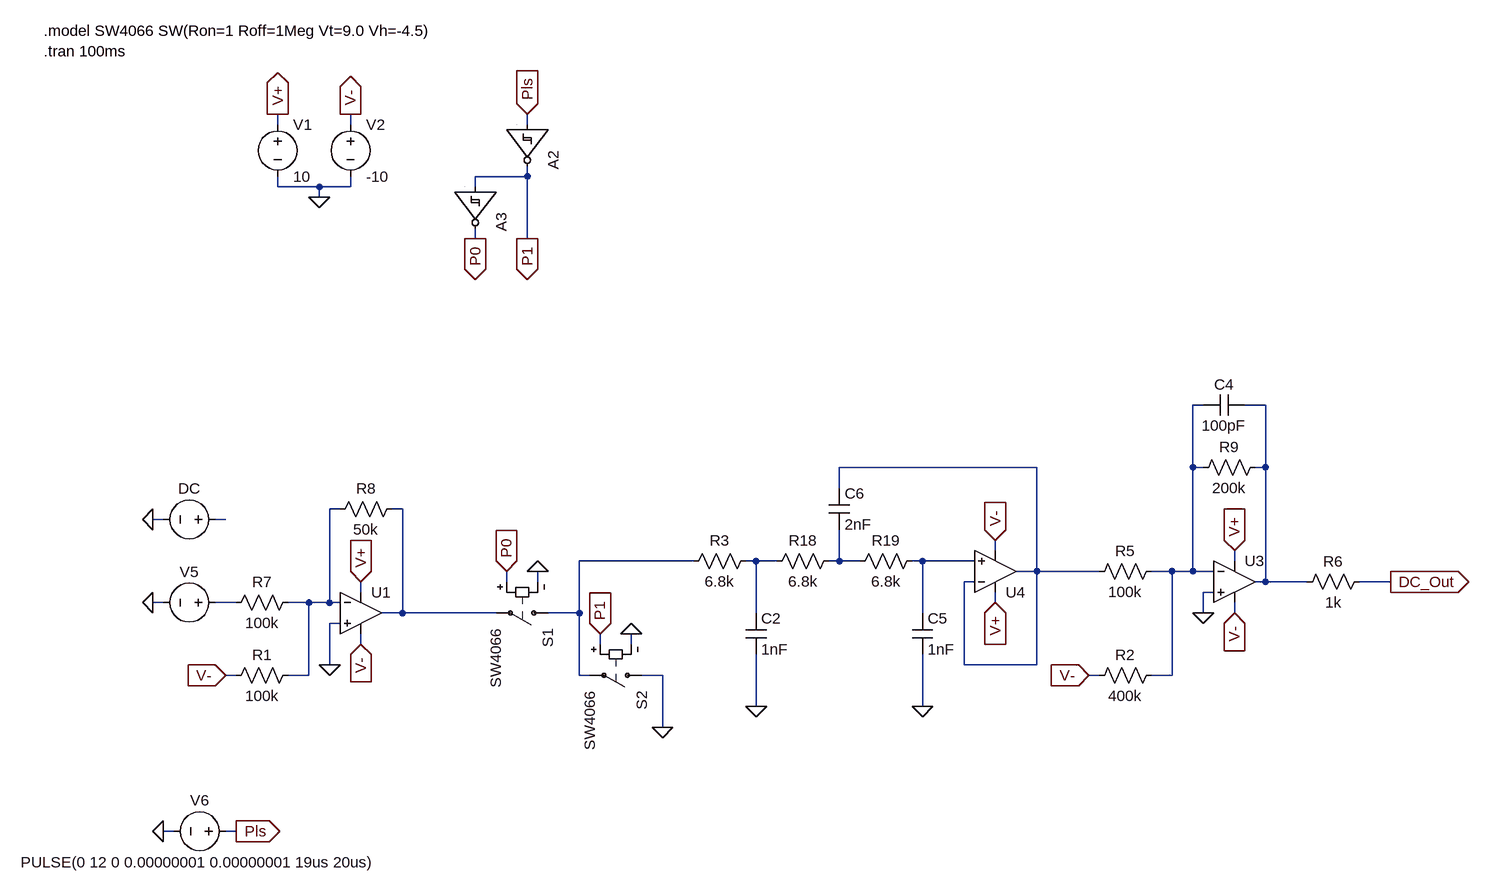
[diagram p0: schematic vca_audio_path_dc_coupled.asc]
vca_audio_path_dc_coupled.asc, the LTspice schematic file:
Version 4
SHEET 1 1140 1560
WIRE -704 176 -704 160
WIRE -592 176 -592 160
WIRE -320 176 -320 160
WIRE -320 256 -320 240
WIRE -320 256 -400 256
WIRE -704 272 -704 256
WIRE -640 272 -704 272
WIRE -592 272 -592 256
WIRE -592 272 -640 272
WIRE -400 272 -400 256
WIRE -640 288 -640 272
WIRE -400 352 -400 336
WIRE -320 352 -320 256
WIRE 720 608 704 608
WIRE 816 608 784 608
WIRE 464 704 160 704
WIRE 704 704 704 608
WIRE 720 704 704 704
WIRE 816 704 816 608
WIRE 816 704 800 704
WIRE 160 736 160 704
WIRE -608 768 -624 768
WIRE -512 768 -528 768
WIRE -880 784 -896 784
WIRE -784 784 -800 784
WIRE 400 832 400 816
WIRE -64 848 -240 848
WIRE 32 848 16 848
WIRE 64 848 32 848
WIRE 160 848 160 800
WIRE 160 848 144 848
WIRE 192 848 160 848
WIRE 288 848 272 848
WIRE 368 848 288 848
WIRE 768 848 768 832
WIRE 464 864 464 704
WIRE 464 864 432 864
WIRE 560 864 464 864
WIRE 672 864 640 864
WIRE 704 864 704 704
WIRE 704 864 672 864
WIRE 736 864 704 864
WIRE -352 880 -352 864
WIRE -304 880 -304 864
WIRE 368 880 352 880
WIRE 816 880 816 704
WIRE 816 880 800 880
WIRE 880 880 816 880
WIRE 1008 880 960 880
WIRE -576 896 -576 880
WIRE 736 896 720 896
WIRE -880 912 -896 912
WIRE -768 912 -800 912
WIRE -656 912 -688 912
WIRE -624 912 -624 768
WIRE -624 912 -656 912
WIRE -608 912 -624 912
WIRE 400 912 400 896
WIRE -512 928 -512 768
WIRE -512 928 -544 928
WIRE -368 928 -512 928
WIRE -240 928 -240 848
WIRE -240 928 -288 928
WIRE 32 928 32 848
WIRE 288 928 288 848
WIRE 720 928 720 896
WIRE 768 928 768 912
WIRE -608 944 -624 944
WIRE -576 976 -576 960
WIRE -208 976 -208 960
WIRE -160 976 -160 960
WIRE -624 1008 -624 944
WIRE 352 1008 352 880
WIRE 464 1008 464 864
WIRE 464 1008 352 1008
WIRE -768 1024 -784 1024
WIRE -656 1024 -656 912
WIRE -656 1024 -688 1024
WIRE -240 1024 -240 928
WIRE -224 1024 -240 1024
WIRE -112 1024 -144 1024
WIRE 560 1024 544 1024
WIRE 672 1024 672 864
WIRE 672 1024 640 1024
WIRE 32 1072 32 992
WIRE 288 1072 288 992
WIRE -112 1104 -112 1024
WIRE -864 1264 -880 1264
WIRE -768 1264 -784 1264
FLAG -592 160 V-
IOPIN -592 160 Out
FLAG -704 160 V+
IOPIN -704 160 Out
FLAG -640 288 0
FLAG -768 1264 Pls
IOPIN -768 1264 Out
FLAG -576 976 V-
IOPIN -576 976 In
FLAG -576 880 V+
IOPIN -576 880 In
FLAG -896 912 0
FLAG -304 864 0
FLAG -320 160 Pls
IOPIN -320 160 In
FLAG -160 960 0
FLAG 400 816 V-
IOPIN 400 816 In
FLAG 400 912 V+
IOPIN 400 912 In
FLAG -880 1264 0
FLAG -112 1104 0
FLAG -624 1008 0
FLAG 768 928 V-
IOPIN 768 928 In
FLAG 768 832 V+
IOPIN 768 832 In
FLAG -320 352 P1
IOPIN -320 352 Out
FLAG -400 352 P0
IOPIN -400 352 Out
FLAG -352 864 P0
IOPIN -352 864 In
FLAG -208 960 P1
IOPIN -208 960 In
FLAG 32 1072 0
FLAG 288 1072 0
FLAG -896 784 0
FLAG -784 1024 V-
IOPIN -784 1024 In
FLAG 544 1024 V-
IOPIN 544 1024 In
FLAG 1008 880 DC_Out
IOPIN 1008 880 Out
FLAG 720 928 0
SYMBOL voltage -704 160 R0
SYMATTR InstName V1
SYMATTR Value 10
SYMBOL voltage -592 160 R0
SYMATTR InstName V2
SYMATTR Value -10
SYMBOL res -672 896 R90
WINDOW 0 0 56 VBottom 2
WINDOW 3 32 56 VTop 2
SYMATTR InstName R7
SYMATTR Value 100k
SYMBOL voltage -784 912 R90
WINDOW 0 -32 56 VBottom 2
WINDOW 3 32 56 Invisible 2
SYMATTR InstName V5
SYMATTR Value PULSE(-5 5 0 2.5ms 2.5ms 0.0ms 5ms)
SYMBOL res -512 752 R90
WINDOW 0 0 56 VBottom 2
WINDOW 3 32 56 VTop 2
SYMATTR InstName R8
SYMATTR Value 50k
SYMBOL sw -272 928 R90
SYMATTR InstName S1
SYMATTR Value SW4066
SYMBOL Digital/schmtinv -256 176 R90
WINDOW 3 8 54 Left 2
SYMATTR InstName A2
SYMATTR SpiceLine VHigh=10 Vt=4.9 Vh=1.0 Trise=1ns Tfall=1ns
SYMBOL sw -128 1024 R90
SYMATTR InstName S2
SYMATTR Value SW4066
SYMBOL Digital/schmtinv -336 272 R90
WINDOW 3 8 54 Left 2
SYMATTR InstName A3
SYMATTR SpiceLine VHigh=10 Vt=4.9 Vh=1.0 Trise=1ns Tfall=1ns
SYMBOL res 160 832 R90
WINDOW 0 0 56 VBottom 2
WINDOW 3 32 56 VTop 2
SYMATTR InstName R18
SYMATTR Value 6.8k
SYMBOL cap 272 928 R0
SYMATTR InstName C5
SYMATTR Value 1nF
SYMBOL cap 144 736 R0
SYMATTR InstName C6
SYMATTR Value 2nF
SYMBOL res 288 832 R90
WINDOW 0 0 56 VBottom 2
WINDOW 3 32 56 VTop 2
SYMATTR InstName R19
SYMATTR Value 6.8k
SYMBOL voltage -768 1264 R90
WINDOW 0 -32 56 VBottom 2
WINDOW 3 32 56 VTop 2
WINDOW 39 0 0 Left 0
SYMATTR InstName V6
SYMATTR Value PULSE(0 12 0 0.00000001 0.00000001 19us 20us)
SYMBOL res 864 896 R270
WINDOW 0 32 56 VTop 2
WINDOW 3 0 56 VBottom 2
SYMATTR InstName R6
SYMATTR Value 1k
SYMBOL res 656 848 R90
WINDOW 0 0 56 VBottom 2
WINDOW 3 32 56 VTop 2
SYMATTR InstName R5
SYMATTR Value 100k
SYMBOL OpAmps/UniversalOpAmp 768 880 R0
SYMATTR InstName U3
SYMBOL OpAmps/UniversalOpAmp 400 864 M180
SYMATTR InstName U4
SYMBOL OpAmps/UniversalOpAmp -576 928 R0
SYMATTR InstName U1
SYMBOL cap 16 928 R0
SYMATTR InstName C2
SYMATTR Value 1nF
SYMBOL res 32 832 R90
WINDOW 0 0 56 VBottom 2
WINDOW 3 32 56 VTop 2
SYMATTR InstName R3
SYMATTR Value 6.8k
SYMBOL cap 784 592 R90
WINDOW 0 0 32 VBottom 2
WINDOW 3 32 32 VTop 2
SYMATTR InstName C4
SYMATTR Value 100pF
SYMBOL res 816 688 R90
WINDOW 0 0 56 VBottom 2
WINDOW 3 32 56 VTop 2
SYMATTR InstName R9
SYMATTR Value 200k
SYMBOL voltage -784 784 R90
WINDOW 0 -32 56 VBottom 2
WINDOW 3 32 56 Invisible 2
SYMATTR InstName DC
SYMATTR Value 7
SYMBOL res -672 1008 R90
WINDOW 0 0 56 VBottom 2
WINDOW 3 32 56 VTop 2
SYMATTR InstName R1
SYMATTR Value 100k
SYMBOL res 656 1008 R90
WINDOW 0 0 56 VBottom 2
WINDOW 3 32 56 VTop 2
SYMATTR InstName R2
SYMATTR Value 400k
TEXT -1064 32 Left 2 !.model SW4066 SW(Ron=1 Roff=1Meg Vt=9.0 Vh=-4.5)\n.tran 100ms

The netlist it stands for:
* vca_audio_path_dc_coupled.asc
V1 V+ 0 10
V2 V- 0 -10
R7 N004 N011 100k
V5 N011 0 PULSE(-5 5 0 2.5ms 2.5ms 0.0ms 5ms)
R8 N005 N004 50k
S1 N007 N005 P0 0 SW4066
A2 Pls 0 0 0 0 P1 0 0 SCHMITT VHigh=10 Vt=4.9 Vh=1.0 Trise=1ns Tfall=1ns
S2 0 N007 P1 0 SW4066
A3 P1 0 0 0 0 P0 0 0 SCHMITT VHigh=10 Vt=4.9 Vh=1.0 Trise=1ns Tfall=1ns
R18 N009 N008 6.8k
C5 N010 0 1nF
C6 N003 N009 2nF
R19 N010 N009 6.8k
V6 Pls 0 PULSE(0 12 0 0.00000001 0.00000001 19us 20us)
R6 N002 DC_Out 1k
R5 N001 N003 100k
XU3 0 N001 V+ V- N002 level1 Avol=1Meg GBW=10Meg Vos=0 En=0 Enk=0 In=0 Ink=0 Rin=500Meg  ; pins In+ In- V+ V- OUT
XU4 N010 N003 V+ V- N003 level1 Avol=1Meg GBW=10Meg Vos=0 En=0 Enk=0 In=0 Ink=0 Rin=500Meg  ; pins In+ In- V+ V- OUT
XU1 0 N004 V+ V- N005 level1 Avol=1Meg GBW=10Meg Vos=0 En=0 Enk=0 In=0 Ink=0 Rin=500Meg  ; pins In+ In- V+ V- OUT
C2 N008 0 1nF
R3 N008 N007 6.8k
C4 N002 N001 100pF
R9 N002 N001 200k
V§DC N006 0 7
R1 N004 V- 100k
R2 N001 V- 400k
.model SW4066 SW(Ron=1 Roff=1Meg Vt=9.0 Vh=-4.5)
.tran 100ms
.lib UniversalOpAmp1.lib
.backanno
.end